# Altium schematic sheet GPS.SchDoc
size A4; SheetNumber: 5; SheetTotal: 5
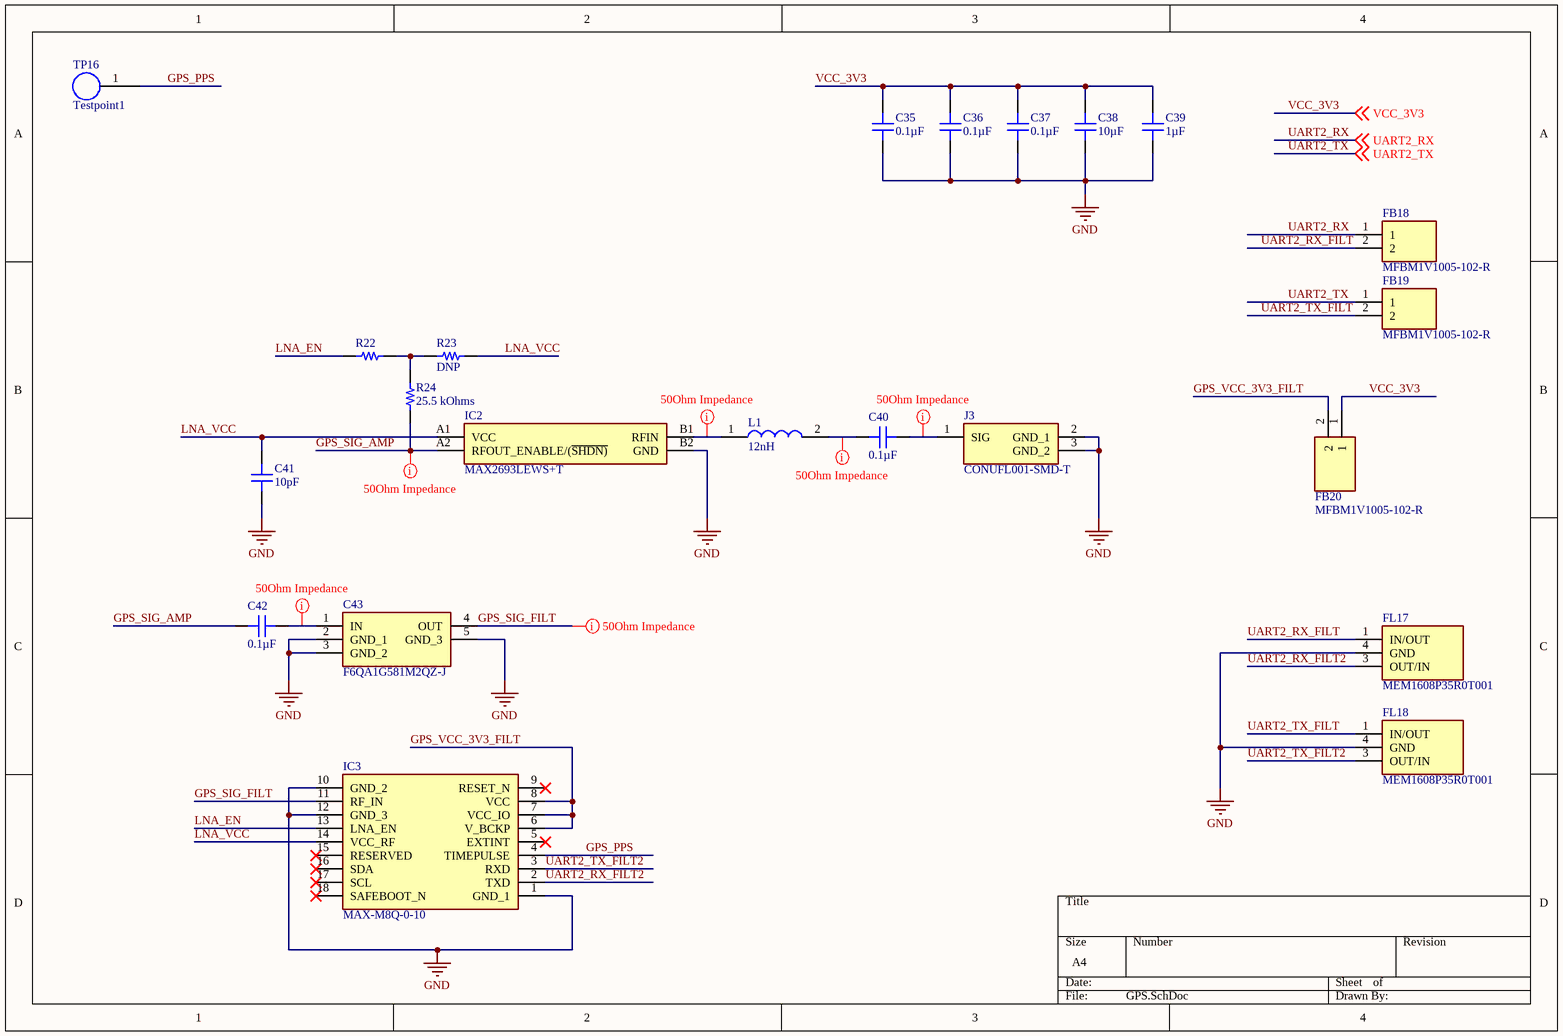
[diagram p0: GPS.SchDoc]

## Parts
C35  0.1µF  [CAP 0402_1005]
C36  0.1µF  [CAP 0402_1005]
C37  0.1µF  [CAP 0402_1005]
C38  10µF  [CAP 0402_1005]
C39  1µF  [CAP 0402_1005]
C40  0.1µF  [CAP 0402_1005]
C41  10pF  [CAP 0402_1005]
C42  0.1µF  [CAP 0402_1005]
C43  F6QA1G581M2QZ-J  [F6QA1G581M2QZJ]
FB18  MFBM1V1005-102-R  [BEADC1005X65N]
FB19  MFBM1V1005-102-R  [BEADC1005X65N]
FB20  MFBM1V1005-102-R  [BEADC1005X65N]
FL17  MEM1608P35R0T001  [MEM1608P35R0T001]
FL18  MEM1608P35R0T001  [MEM1608P35R0T001]
IC2  MAX2693LEWS+T  [BGA4C40P2X2_84X84X69]
IC3  MAX-M8Q-0-10  [MAX-M8]
J3  CONUFL001-SMD-T  [CONUFL001-SMD]
L1  12nH  [INDC1005X55N]
R22  (no value)  [RES 0402_1005]
R23  Assembly Instruction: DNP  [RES 0402_1005]
R24  25.5 kOhms  [RES 0402_1005]
TP16  Testpoint1  [Testpoint1]  (no BOM)

## Nets
GND: C35.1 C36.1 C37.1 C38.1 C39.1 C41.1 C43.2(GND_1) C43.3(GND_2) C43.5(GND_3) FL17.4(GND) FL18.4(GND) IC2.B2(GND) IC3.1(GND_1) IC3.10(GND_2) IC3.12(GND_3) J3.2(GND_1) J3.3(GND_2)
GPS_PPS: IC3.4(TIMEPULSE) TP16.1
GPS_SIG_AMP: C42.2 IC2.A2(RFOUT_ENABLE/(~{SHDN)}) R24.1
GPS_SIG_FILT: C43.4(OUT) IC3.11(RF_IN)
GPS_VCC_3V3_FILT: FB20.2 IC3.6(V_BCKP) IC3.7(VCC_IO) IC3.8(VCC)
LNA_EN: IC3.13(LNA_EN) R22.2
LNA_VCC: C41.2 IC2.A1(VCC) IC3.14(VCC_RF) R23.1
UART2_RX: FB18.1 ; off-sheet UART2_RX
UART2_RX_FILT: FB18.2 FL17.1(IN/OUT)
UART2_RX_FILT2: FL17.3(OUT/IN) IC3.2(TXD)
UART2_TX: FB19.1 ; off-sheet UART2_TX
UART2_TX_FILT: FB19.2 FL18.1(IN/OUT)
UART2_TX_FILT2: FL18.3(OUT/IN) IC3.3(RXD)
VCC_3V3: C35.2 C36.2 C37.2 C38.2 C39.2 FB20.1 ; off-sheet VCC_3V3
NetC40_1: C40.1 J3.1(SIG)
NetC40_2: C40.2 L1.2
NetC42_1: C42.1 C43.1(IN)
NetIC2_B1: IC2.B1(RFIN) L1.1
NetR22_1: R22.1 R23.2 R24.2

Not connected (* = marked no-connect by the designer): IC3 5(EXTINT)* 9(RESET_N)* 15(RESERVED)* 16(SDA)* 17(SCL)* 18(SAFEBOOT_N)*

## Layout directives
net class Z50Ohm: GPS_SIG_AMP, GPS_SIG_FILT, NetC40_1, NetC40_2, NetC42_1, NetIC2_B1

## Library data of the parts
C35-C37 C40 C42 = C0402C104K9PACTU: CAP CER 0.1UF 6.3V X5R 0402; Manufacturer: KEMET; Tolerance: ±10%; Part Number: C0402C104K9PACTU; Value: 0.1µF; Applications: General Purpose; Capacitance: 0.1µF; ComponentLink1Description: Datasheet; ComponentLink1URL: https://api.kemet.com/component-edge/download/datasheet/C0402C104K9PACTU.pdf; ComponentLink2Description: DigiKey Link; ComponentLink2URL: http://digikey.com/product-detail/en/kemet/C0402C104K9PACTU/399-3026-1-ND/447602; Device Package: 0402 (1005 Metric); LastUpdated: 2/9/2020 1:01:34 AM; Lifecycle Status: Active; Minimum Order: 1; Mounting Type: Surface Mount, MLCC; Operating Temperature: -55°C ~ 85°C; Package / Case: 0402 (1005 Metric); Packaging: TapeAndReel; PartId: 12742; Part Status: Active; Price: 0.01; Series: SMD Comm X5R; Size / Dimension: 0.039" L x 0.020" W (1.00mm x 0.50mm); Supplier 1: DigiKey; Supplier Part Number 1: 399-3026-1-ND; Temperature Coefficient: X5R; Thickness (Max): 0.022" (0.55mm); Voltage - Rated: 6.3V
C38 = C0402C106M9PAC7867: CAP CER 10UF 6.3V X5R 0402; Manufacturer: KEMET; Tolerance: ±20%; Part Number: C0402C106M9PAC7867; Value: 10µF; Applications: General Purpose; Capacitance: 10µF; ComponentLink1Description: Datasheet; ComponentLink1URL: https://api.kemet.com/component-edge/download/datasheet/C0402C106M9PAC7867.pdf; ComponentLink2Description: DigiKey Link; ComponentLink2URL: http://digikey.com/product-detail/en/kemet/C0402C106M9PAC7867/399-13069-1-ND/5767556; Device Package: 0402 (1005 Metric); LastUpdated: 2/9/2020 1:02:21 AM; Lifecycle Status: Active; Minimum Order: 1; Mounting Type: Surface Mount, MLCC; Operating Temperature: -55°C ~ 85°C; Package / Case: 0402 (1005 Metric); Packaging: TapeAndReel; PartId: 3087; Part Status: Active; Price: 0.13; Series: SMD Comm X5R; Size / Dimension: 0.039" L x 0.020" W (1.00mm x 0.50mm); Supplier 1: DigiKey; Supplier Part Number 1: 399-13069-1-ND; Temperature Coefficient: X5R; Thickness (Max): 0.028" (0.70mm); Voltage - Rated: 6.3V
C39 = 0402YD105KAT2A: CAP CER 1UF 16V X5R 0402; Manufacturer: AVX Corporation; Tolerance: ±10%; Part Number: 0402YD105KAT2A; Value: 1µF; Applications: General Purpose; Capacitance: 1µF; ComponentLink1Description: Datasheet; ComponentLink1URL: http://datasheets.avx.com/cx5r.pdf; ComponentLink2Description: DigiKey Link; ComponentLink2URL: http://digikey.com/product-detail/en/avx-corporation/0402YD105KAT2A/478-10179-1-ND/6797606; Device Package: 0402 (1005 Metric); LastUpdated: 2/9/2020 1:02:22 AM; Lifecycle Status: Active; Minimum Order: 1; Mounting Type: Surface Mount, MLCC; Operating Temperature: -55°C ~ 85°C; Package / Case: 0402 (1005 Metric); Packaging: TapeAndReel; PartId: 2859; Part Status: Active; Price: 0.07; Series: -; Size / Dimension: 0.039" L x 0.020" W (1.00mm x 0.50mm); Supplier 1: DigiKey; Supplier Part Number 1: 478-10179-1-ND; Temperature Coefficient: X5R; Thickness (Max): 0.022" (0.55mm); Voltage - Rated: 16V
C41 = 0402N100G500CT: CAP CER 10PF 50V C0G/NP0 0402; Manufacturer: Walsin Technology Corporation; Temperature Coefficient: C0G, NP0; Tolerance: ±2%; Part Number: 0402N100G500CT; Value: 10pF; Applications: General Purpose; Capacitance: 10pF; ComponentLink1Description: Datasheet; ComponentLink1URL: http://www.passivecomponent.com/wp-content/uploads/2018/10/MLCC.pdf; ComponentLink2Description: DigiKey Link; ComponentLink2URL: http://digikey.com/product-detail/en/walsin-technology-corporation/0402N100G500CT/1292-1237-1-ND/9355241; Device Package: 0402 (1005 Metric); LastUpdated: 2/9/2020 1:02:04 AM; Lifecycle Status: Active; Minimum Order: 1; Mounting Type: Surface Mount, MLCC; Operating Temperature: -55°C ~ 125°C; Package / Case: 0402 (1005 Metric); Packaging: TapeAndReel; PartId: 10726; Part Status: Active; Price: 0.01; Series: -; Size / Dimension: 0.039" L x 0.020" W (1.00mm x 0.50mm); Supplier 1: DigiKey; Supplier Part Number 1: 1292-1237-1-ND; Thickness (Max): 0.022" (0.55mm); Voltage - Rated: 50V
C43 = F6QA1G581M2QZ-J: Capacitor; Manufacturer_Name: TAIYO YUDEN; Datasheet Link: https://componentsearchengine.com/Datasheets/2/F6QA1G581M2QZ-J.pdf; Height: 0.5mm; Manufacturer_Part_Number: F6QA1G581M2QZ-J
FB18-FB20 = MFBM1V1005-102-R: Ferrite Bead; Manufacturer_Name: Eaton; Manufacturer_Part_Number: MFBM1V1005-101-R; Assembly Instruction: DNP; Datasheet Link: https://www.mouser.in/datasheet/2/87/eaton_mfbm1v1005_high_current_multilayer_ferrite_c-1890673.pdf; Height: 0.65mm
FL17 FL18 = MEM1608P35R0T001: Filter; Manufacturer_Name: TDK; Datasheet Link: https://product.tdk.com/system/files/dam/doc/product/emc/emc/3tf/catalog/3tf_commercial_signal_mem1608p_en.pdf; Height: 0.7mm; Manufacturer_Part_Number: MEM1608P35R0T001
IC2 = MAX2693LEWS+T: Integrated Circuit; Manufacturer_Name: Maxim Integrated; Datasheet Link: https://pdfserv.maximintegrated.com/en/ds/MAX2686L-MAX2693L.pdf; Height: 0.69mm; Manufacturer_Part_Number: MAX2693LEWS+T
IC3 = MAX-M8Q-0-10: Integrated Circuit; Manufacturer_Name: U-Blox; Datasheet Link: https://www.u-blox.com/sites/default/files/MAX-M8-FW3_DataSheet_%28UBX-15031506%29.pdf; Manufacturer_Part_Number: MAX-M8Q-0-10
J3 = CONUFL001-SMD-T: Connector; Manufacturer_Name: Linx Technologies; Datasheet Link: https://componentsearchengine.com//CONUFL001-SMD-T.pdf; Mouser2 Part Number: 712-CONUFL001-SMD-T; Mouser2 Price/Stock: https://www.mouser.com/Search/Refine.aspx?Keyword=712-CONUFL001-SMD-T; Manufacturer_Part_Number: CONUFL001-SMD-T
L1 = 7447840112G: Inductor; Manufacturer_Name: Wurth Elektronik; Datasheet Link: https://www.mouser.sg/datasheet/2/445/7447840112G-2492224.pdf; Height: 0.55mm; Manufacturer_Part_Number: 7447840112G
R22 R23 = CRCW04020000Z0ED: RES SMD 0 OHM JUMPER 1/16W 0402; Manufacturer: Vishay Dale; Power (Watts): 0.063W, 1/16W; Part Number: CRCW04020000Z0ED; ComponentLink1Description: Datasheet; ComponentLink1URL: http://www.vishay.com/docs/20035/dcrcwe3.pdf; ComponentLink2Description: DigiKey Link; ComponentLink2URL: http://digikey.com/product-detail/en/vishay-dale/CRCW04020000Z0ED/541-0.0JCT-ND/1182611; Composition: Thick Film; Device Package: 0402 (1005 Metric); Features: Automotive AEC-Q200; Height - Seated (Max): 0.016" (0.40mm); LastUpdated: 2/9/2020 1:07:36 AM; Lifecycle Status: Active; Minimum Order: 1; Number of Terminations: 2; Operating Temperature: -55°C ~ 155°C; Package / Case: 0402 (1005 Metric); Packaging: CutTape; PartId: 17634; Part Status: Active; Price: 0.10; Ratings: AEC-Q200; Series: CRCW; Size / Dimension: 0.039" L x 0.020" W (1.00mm x 0.50mm); Supplier 1: DigiKey; Supplier Part Number 1: 541-0.0JCT-ND; Supplier Device Package: 0402; Tolerance: Jumper
R24 = AC0402FR-0725K5L: RES SMD 25.5K OHM 1% 1/16W 0402; Manufacturer: Yageo; Power (Watts): 0.063W, 1/16W; Temperature Coefficient: ±100ppm/°C; Part Number: AC0402FR-0725K5L; Value: 25.5 kOhms; ComponentLink1Description: Datasheet; ComponentLink1URL: https://www.yageo.com/upload/media/product/productsearch/datasheet/rchip/PYu-AC_51_RoHS_L_7.pdf; ComponentLink2Description: DigiKey Link; ComponentLink2URL: http://digikey.com/product-detail/en/yageo/AC0402FR-0725K5L/YAG5657CT-ND/7563677; Composition: Thick Film; Device Package: 0402 (1005 Metric); Features: Automotive AEC-Q200, Moisture Resistant; Height - Seated (Max): 0.015" (0.37mm); LastUpdated: 2/9/2020 1:07:41 AM; Lifecycle Status: Active; Minimum Order: 1; Number of Terminations: 2; Operating Temperature: -55°C ~ 155°C; Package / Case: 0402 (1005 Metric); Packaging: CutTape; PartId: 15874; Part Status: Active; Price: 0.10; Ratings: AEC-Q200; Resistance: 25.5 kOhms; Series: AC; Size / Dimension: 0.039" L x 0.020" W (1.00mm x 0.50mm); Supplier 1: DigiKey; Supplier Part Number 1: YAG5657CT-ND; Supplier Device Package: 0402; Tolerance: ±1%